# EAGLE design untitled (EAGLE 6.2)
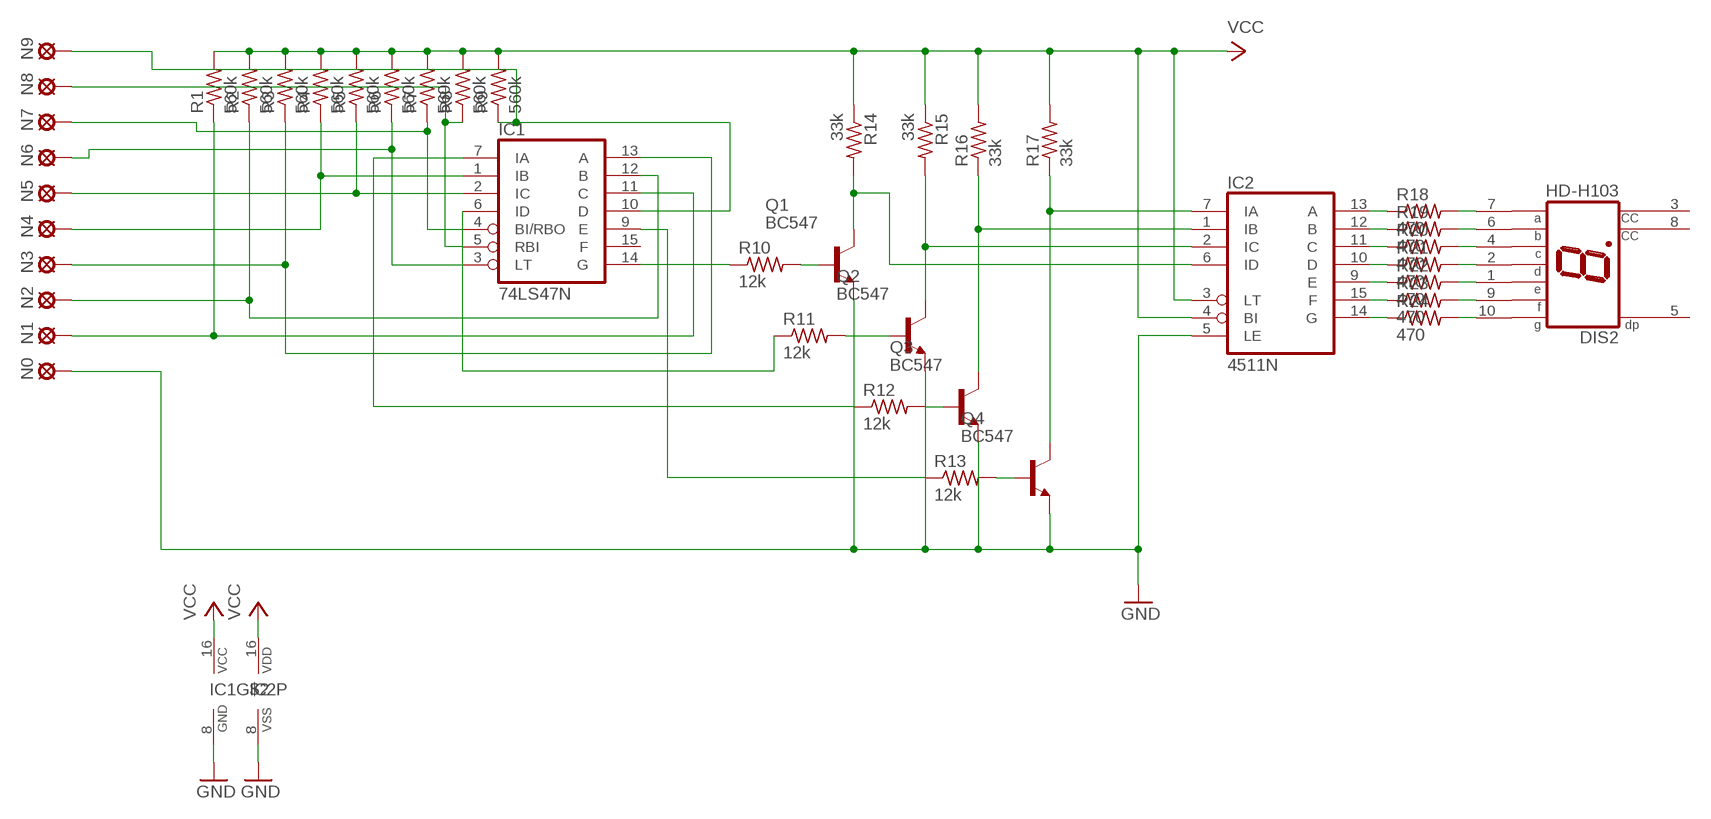
[diagram p0: schematic, sheet 1]

## Parts
DIS2  HD-H103  [HDSP-M]
IC1  74LS47N  [DIL16]
IC2  4511N  [DIL16]
N0  LSP10  [LSP10]
N1  LSP10  [LSP10]
N2  LSP10  [LSP10]
N3  LSP10  [LSP10]
N4  LSP10  [LSP10]
N5  LSP10  [LSP10]
N6  LSP10  [LSP10]
N7  LSP10  [LSP10]
N8  LSP10  [LSP10]
N9  LSP10  [LSP10]
Q1  BC547  [TO92]
Q2  BC547  [TO92]
Q3  BC547  [TO92]
Q4  BC547  [TO92]
R1  560k  R-US_0204/7  [0204/7]
R2  560k  R-US_0204/7  [0204/7]
R3  560k  R-US_0204/7  [0204/7]
R4  560k  R-US_0204/7  [0204/7]
R5  560k  R-US_0204/7  [0204/7]
R6  560k  R-US_0204/7  [0204/7]
R7  560k  R-US_0204/7  [0204/7]
R8  560k  R-US_0204/7  [0204/7]
R9  560k  R-US_0204/7  [0204/7]
R10  12k  R-US_0204/7  [0204/7]
R11  12k  R-US_0204/7  [0204/7]
R12  12k  R-US_0204/7  [0204/7]
R13  12k  R-US_0204/7  [0204/7]
R14  33k  R-US_0204/7  [0204/7]
R15  33k  R-US_0204/7  [0204/7]
R16  33k  R-US_0204/7  [0204/7]
R17  33k  R-US_0204/7  [0204/7]
R18  470  R-US_0204/7  [0204/7]
R19  470  R-US_0204/7  [0204/7]
R20  470  R-US_0204/7  [0204/7]
R21  470  R-US_0204/7  [0204/7]
R22  470  R-US_0204/7  [0204/7]
R23  470  R-US_0204/7  [0204/7]
R24  470  R-US_0204/7  [0204/7]

## Nets
GND: IC1.8(GND) IC2.5(LE) IC2.8(VSS) N0.MP Q1.1(E) Q2.1(E) Q3.1(E) Q4.1(E)
N$2: IC1.11(C) N1.MP R1.1
N$3: IC1.12(B) N2.MP R2.1
N$4: Q1.2(B) R10.2
N$5: IC1.13(A) N3.MP R3.1
N$6: IC1.1(IB) N4.MP R4.1
N$7: IC1.2(IC) N5.MP R5.1
N$9: IC1.4(BI/RBO) N7.MP R7.1
N$10: IC1.5(RBI) N8.MP R8.1
N$11: IC1.10(D) N9.MP R9.1
N$12: IC1.14(G) R10.1
N$13: IC1.3(LT) N6.MP R6.1
N$14: DIS2.10(G) R24.2
N$15: Q2.2(B) R11.2
N$16: IC1.6(ID) R11.1
N$18: IC2.6(ID) Q1.3(C) R14.2
N$19: Q3.2(B) R12.2
N$20: IC1.7(IA) R12.1
N$22: IC2.2(IC) Q2.3(C) R15.2
N$23: Q4.2(B) R13.2
N$24: IC1.9(E) R13.1
N$26: IC2.1(IB) Q3.3(C) R16.1
N$27: IC2.13(A) R18.1
N$28: IC2.12(B) R19.1
N$29: IC2.11(C) R20.1
N$30: IC2.10(D) R21.1
N$31: IC2.9(E) R22.1
N$32: IC2.15(F) R23.1
N$33: IC2.14(G) R24.1
N$34: DIS2.7(A) R18.2
N$35: DIS2.6(B) R19.2
N$36: DIS2.4(C) R20.2
N$37: DIS2.2(D) R21.2
N$38: DIS2.1(E) R22.2
N$39: DIS2.9(F) R23.2
N$40: IC2.7(IA) Q4.3(C) R17.1
VCC: IC1.16(VCC) IC2.3(LT) IC2.4(BI) IC2.16(VDD) R1.2 R2.2 R3.2 R4.2 R5.2 R6.2 R7.2 R8.2 R9.2 R14.1 R15.1 R16.2 R17.2
Unconnected: DIS2.3(CC) DIS2.5(DP) DIS2.8(CC) IC1.15(F)

## Library data of the parts
DIS2 = display-hp:HD-H103: LED DISPLAY 1-character 7 segment, decimal point right; OC_FARNELL: unknown; OC_NEWARK: unknown
IC1 = 74xx-eu:74*47: BCD to seven segment DECODER/DRIVER Source: http://www.ee.washington.edu/stores/DataSheets/74ls/74ls47.pdf
IC2 = 45xx:4511: BCD to 7-segment LATCH/DECODER/DRIVER
N0 N1-N9 = solpad:LSP10: SOLDER PAD drill 1.0 mm, distributor Buerklin, 12H555
Q1-Q4 = transistor-npn:BC547*: NPN Transistor
R1-R24 = rcl:R-US_: RESISTOR, American symbol

## Board
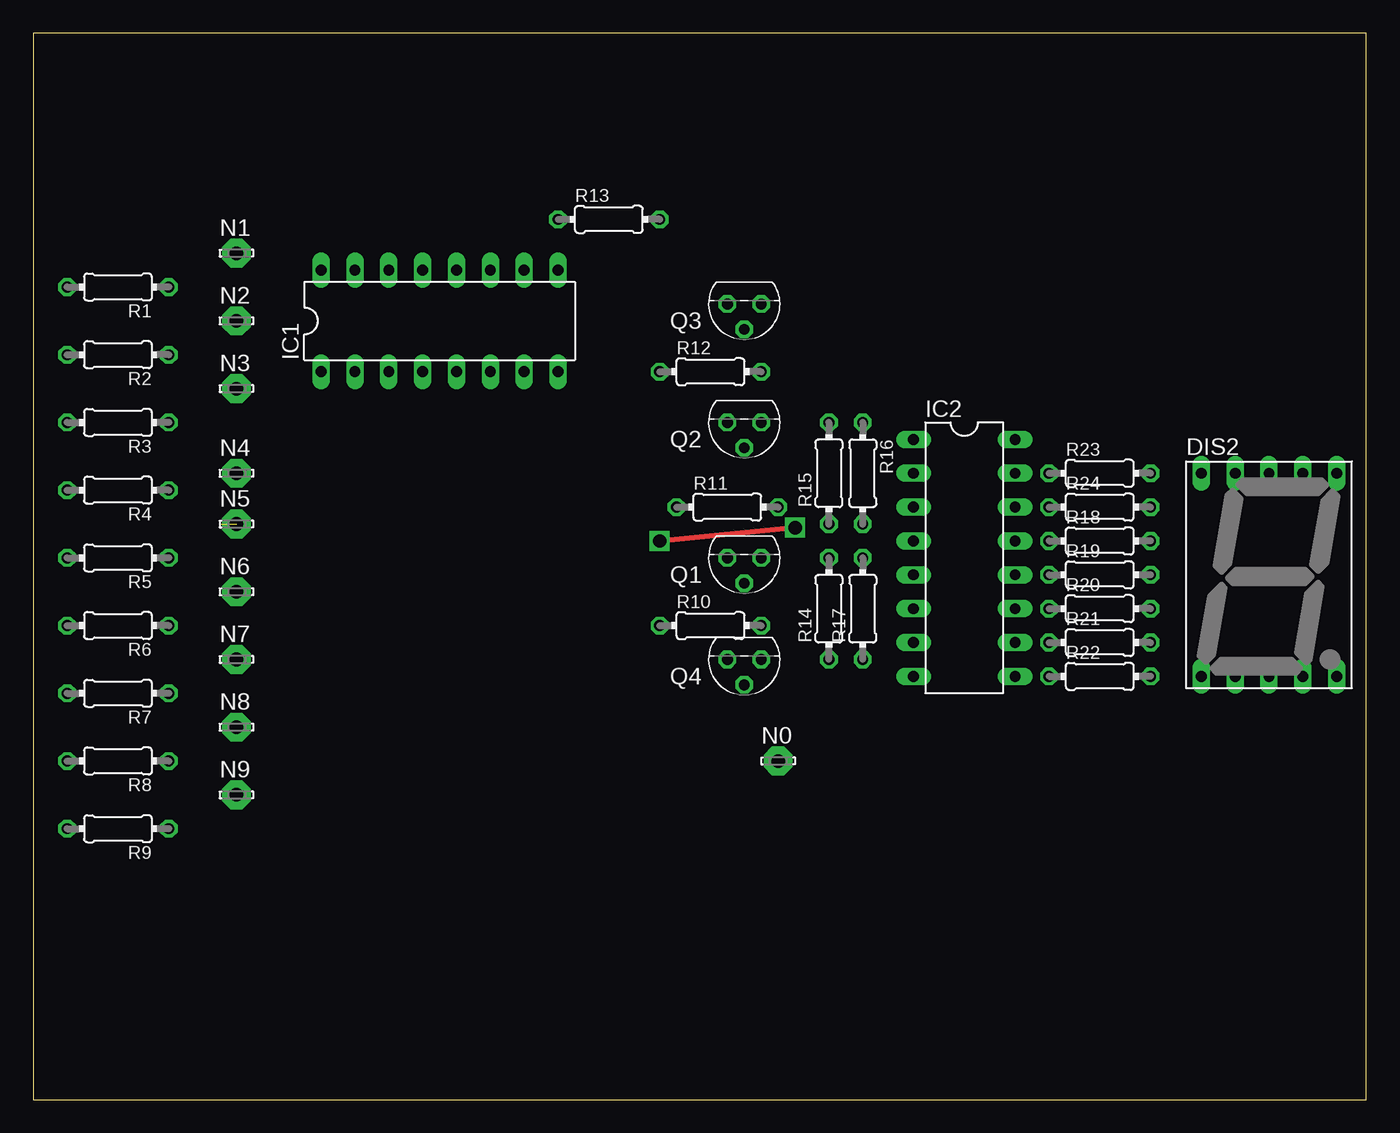
[diagram p1: board, top side]
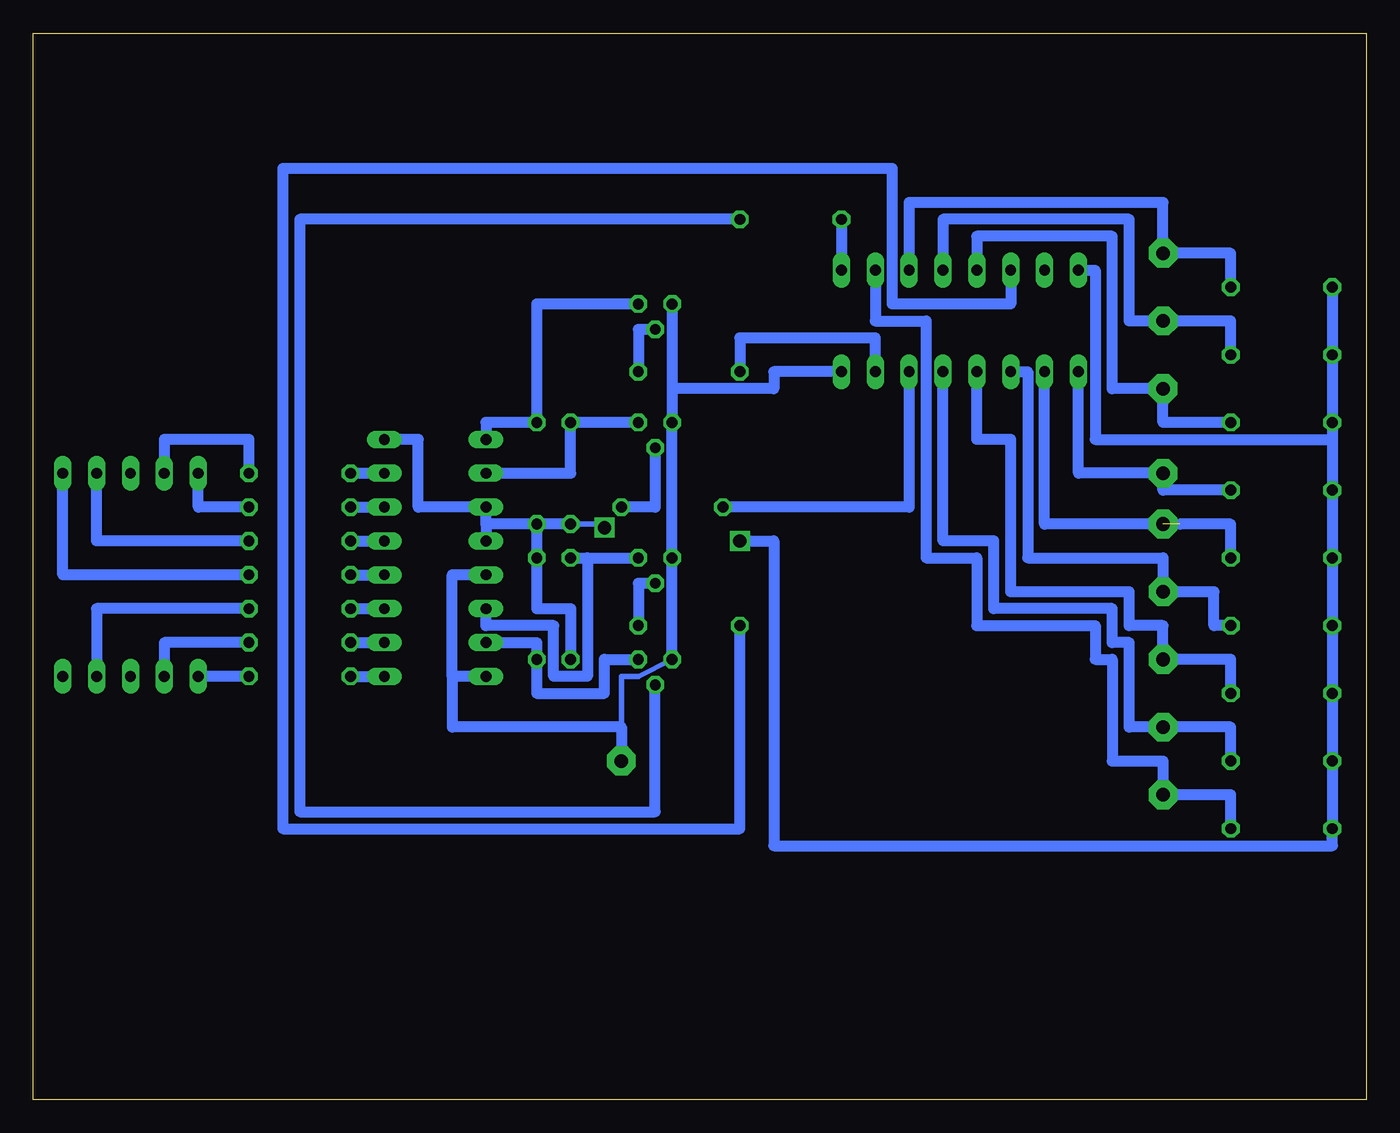
[diagram p2: board, bottom side, seen from below]

Size 100 x 80 mm. Coordinates in mm from the lower left corner, seen from the top.
Outline: 0,0 100,0 100,80 0,80 0,0
Copper layers (1*16): Top 0.035mm / dielectric 1.5mm / Bottom 0.035mm
Design rules: minimum track width 10mil, minimum drill 24mil, track to track 8mil, track to pad 8mil, pad to pad 8mil, via to via 8mil, smd to smd 8mil, copper to edge 40mil, drill to drill 8mil, minimum pad ring 10mil, minimum via ring 8mil, stop-mask expansion 4mil, vias tented up to drill 0mil, thermal gap 10mil

### Footprints (pad centres in the part's own frame; a part is rotated, then mirrored left to right if it is on the bottom)
HDSP-M = drill 0.813 long: 1 -5.08,-7.62; 2 -2.54,-7.62; 3 0,-7.62; 4 2.54,-7.62; 5 5.08,-7.62; 6 5.08,7.62; 7 2.54,7.62; 8 0,7.62; 9 -2.54,7.62; 10 -5.08,7.62
DIL16 = drill 0.813 long: 1 -8.89,-3.81; 2 -6.35,-3.81; 3 -3.81,-3.81; 4 -1.27,-3.81; 5 1.27,-3.81; 6 3.81,-3.81; 7 6.35,-3.81; 8 8.89,-3.81; 9 8.89,3.81; 10 6.35,3.81; 11 3.81,3.81; 12 1.27,3.81; 13 -1.27,3.81; 14 -3.81,3.81; 15 -6.35,3.81; 16 -8.89,3.81
LSP10 = drill 1.016 pad 2.159 octagon: MP 0,0
TO92 = drill 0.813 octagon: 1 1.27,0; 2 0,1.905; 3 -1.27,0
0204/7 = drill 0.813 octagon: 1 -3.81,0; 2 3.81,0

### Placement (x,y rotation side)
DIS2  92.71,39.37 0 top
IC1  30.48,58.42 0 top
IC2  69.85,40.64 270 top
N0  55.88,25.4 0 top
N1  15.24,63.5 0 top
N2  15.24,58.42 0 top
N3  15.24,53.34 0 top
N4  15.24,46.99 0 top
N5  15.24,43.18 0 top
N6  15.24,38.1 0 top
N7  15.24,33.02 0 top
N8  15.24,27.94 0 top
N9  15.24,22.86 0 top
Q1  53.34,40.64 180 top
Q2  53.34,50.8 180 top
Q3  53.34,59.69 180 top
Q4  53.34,33.02 180 top
R1  6.35,60.96 180 top
R2  6.35,55.88 180 top
R3  6.35,50.8 180 top
R4  6.35,45.72 180 top
R5  6.35,40.64 180 top
R6  6.35,35.56 180 top
R7  6.35,30.48 180 top
R8  6.35,25.4 180 top
R9  6.35,20.32 180 top
R10  50.8,35.56 0 top
R11  52.07,44.45 0 top
R12  50.8,54.61 0 top
R13  43.18,66.04 0 top
R14  59.69,36.83 90 top
R15  59.69,46.99 90 top
R16  62.23,46.99 270 top
R17  62.23,36.83 90 top
R18  80.01,41.91 0 top
R19  80.01,39.37 0 top
R20  80.01,36.83 0 top
R21  80.01,34.29 0 top
R22  80.01,31.75 0 top
R23  80.01,46.99 0 top
R24  80.01,44.45 0 top

### Tracks (layer width: path | path; a pad name or v marks a point on that pad's centre or on a via)
GND
  Bottom 0.406: Q4.1 54.61,31.75 55.88,31.75 55.88,27.94
  Bottom 0.813: Q4.1 Q1.1 Q2.1 52.07,53.34 | Q3.1 52.07,53.34 | IC1.8 44.45,54.61 44.45,53.34 52.07,53.34 | IC2.8 68.58,31.75 | 68.58,31.75 68.58,39.37 IC2.5 | 68.58,31.75 68.58,27.94 55.88,27.94 N0.MP
N$2
  Bottom 0.813: R1.1 10.16,63.5 N1.MP 15.24,67.31 34.29,67.31 IC1.11
N$3
  Bottom 0.813: R2.1 10.16,58.42 N2.MP 17.78,58.42 17.78,66.04 31.75,66.04 IC1.12
N$4
  Bottom 0.813: Q1.2 54.61,38.73 R10.2
N$5
  Bottom 0.813: R3.1 15.24,50.8 N3.MP 19.05,53.34 19.05,64.77 29.21,64.77 IC1.13
N$6
  Bottom 0.813: R4.1 15.24,45.72 N4.MP 21.59,46.99 IC1.1
N$7  (1 unrouted)
  Bottom 0.813: R5.1 10.16,43.18 13.97,43.18 | N5.MP 24.13,43.18 IC1.2
N$9
  Bottom 0.813: R7.1 10.16,33.02 N7.MP 15.24,35.56 17.78,35.56 17.78,38.1 26.67,38.1 26.67,49.53 29.21,49.53 IC1.4
N$10
  Bottom 0.813: R8.1 10.16,27.94 N8.MP 17.78,27.94 17.78,34.29 19.05,34.29 19.05,36.83 27.94,36.83 27.94,41.91 31.75,41.91 IC1.5
N$11
  Bottom 0.813: R9.1 10.16,22.86 N9.MP 15.24,25.4 19.05,25.4 19.05,33.02 20.32,33.02 20.32,35.56 29.21,35.56 29.21,40.64 33.02,40.64 33.02,58.42 36.83,58.42 IC1.10
N$12
  Bottom 0.813: IC1.14 26.67,59.69 35.56,59.69 35.56,69.85 81.28,69.85 81.28,20.32 46.99,20.32 R10.1
N$13
  Bottom 0.813: R6.1 11.43,35.56 11.43,38.1 N6.MP 15.24,40.64 25.4,40.64 25.4,54.61 IC1.3
N$14
  Bottom 0.813: R24.2 87.63,44.45 DIS2.10
N$15
  Bottom 0.813: Q2.2 53.34,44.45 R11.2
N$16
  Bottom 0.813: IC1.6 34.29,44.45 R11.1
N$18
  Bottom 0.813: Q1.3 R14.2 58.42,40.64 58.42,31.75 60.96,31.75 60.96,35.56 66.04,35.56 IC2.6
N$19
  Bottom 0.813: Q3.2 54.61,57.78 R12.2
N$20
  Bottom 0.813: IC1.7 36.83,57.15 46.99,57.15 R12.1
N$22
  Bottom 0.813: Q2.3 R15.2 59.69,46.99 IC2.2
N$23
  Bottom 0.813: R13.2 80.01,66.04 80.01,21.59 53.34,21.59 Q4.2
N$24
  Bottom 0.813: R13.1 IC1.9
N$26
  Bottom 0.813: Q3.3 62.23,59.69 R16.1 66.04,50.8 IC2.1
N$27
  Bottom 0.813: R18.1 IC2.13
N$28
  Bottom 0.813: R19.1 IC2.12
N$29
  Bottom 0.813: R20.1 IC2.11
N$30
  Bottom 0.813: R21.1 IC2.10
N$31
  Bottom 0.813: R22.1 IC2.9
N$32
  Bottom 0.813: R23.1 IC2.15
N$33
  Bottom 0.813: R24.1 IC2.14
N$34
  Bottom 0.813: R18.2 95.25,41.91 DIS2.7
N$35
  Bottom 0.813: R19.2 97.79,39.37 DIS2.6
N$36
  Bottom 0.813: R20.2 95.25,36.83 DIS2.4
N$37
  Bottom 0.813: R21.2 90.17,34.29 DIS2.2
N$38
  Bottom 0.813: R22.2 DIS2.1
N$39
  Bottom 0.813: R23.2 83.82,49.53 90.17,49.53 DIS2.9
N$40
  Bottom 0.813: IC2.7 62.23,34.29 R17.1 62.23,30.48 57.15,30.48 57.15,33.02 Q4.3
VCC  (via drill 1)
  Top 0.406: v57.15,42.91 v46.99,41.91
  Bottom 0.406: R15.1 57.15,43.18 v57.15,42.91
  Bottom 0.813: 2.54,49.53 R3.2 R2.2 R1.2 | 2.54,49.53 R4.2 R5.2 R6.2 R7.2 R8.2 R9.2 2.54,19.05 44.45,19.05 44.45,41.91 v46.99,41.91 | IC1.16 20.32,62.23 20.32,49.53 2.54,49.53 | R15.1 R16.2 | R16.2 R17.2 62.23,36.83 59.69,36.83 R14.1 | R16.2 66.04,43.18 | 66.04,43.18 IC2.4 | 66.04,43.18 IC2.3 71.12,44.45 71.12,49.53 IC2.16